# Altium schematic sheet nrf_ha_sensor_USB.SchDoc: PCA70141 MCU
size A4; DocumentNumber: 2; Revision: 0; SheetNumber: 2; SheetTotal: 4; ProjectNumber: <Project number>; DocumentSize: A4; PCBRevision: <PCB designer code>
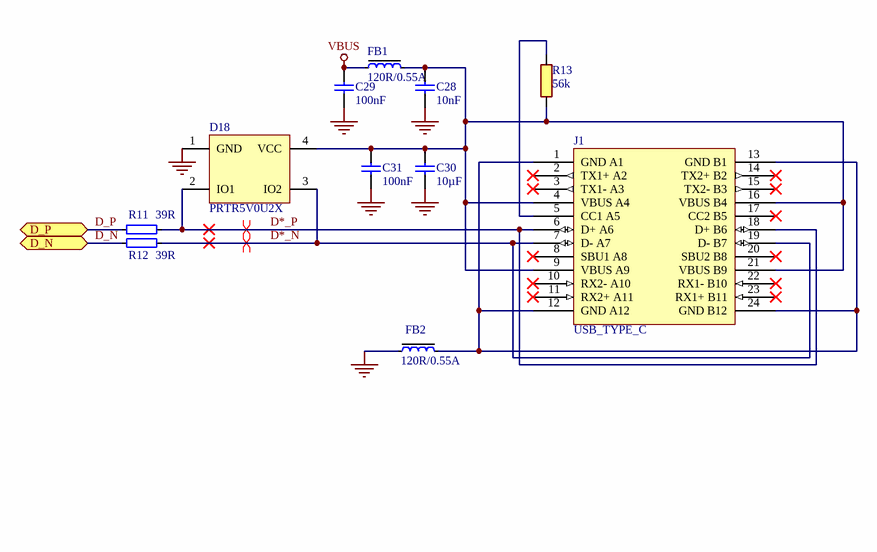
[diagram p0: nrf_ha_sensor_USB.SchDoc]

## Parts
C28  10nF  [CAPC1005X04L]
C29  100nF  [CAPC1005X04L]
C30  10µF  [CAPC1608X06L]
C31  100nF  [CAPC1005X04L]
D18  PRTR5V0U2X  [SOT190P230X110-4L]
FB1  120R/0.55A  [INDC1005X04L]
FB2  120R/0.55A  [INDC1005X04L]
J1  USB_TYPE_C  [USB_TYPE_C_JST]
R11  39R  [RESC1005X04L]
R12  39R  [RESC1005X04L]
R13  56k  [RESC0402(1005)_L]

## Ports
D_N (bidir), D_P (bidir)

## Nets
GND: C28.1 C29.1 C30.1 C31.1 D18.1(GND) FB2.2
VBUS: C29.2 FB1.2
D*_N: D18.3(IO2) J1.7(D-_A7) J1.19(D-_B7) R11.2
D*_P: D18.2(IO1) J1.6(D+_A6) J1.18(D+_B6) R12.2
D_N: R11.1 ; port D_N
D_P: R12.1 ; port D_P
NetC28_2: C28.2 C30.2 C31.2 D18.4(VCC) FB1.1 J1.4(VBUS_A4) J1.9(VBUS_A9) J1.16(VBUS_B4) J1.21(VBUS_B9) R13.1
NetFB2_1: FB2.1 J1.1(GND_A1) J1.12(GND_A12) J1.13(GND_B1) J1.24(GND_B12)
NetJ1_5: J1.5(CC1_A5) R13.2

Not connected (* = marked no-connect by the designer): J1 2(TX1+_A2)* 3(TX1-_A3)* 8(SBU1_A8)* 10(RX2-_A10)* 11(RX2+_A11)* 14(TX2+_B2)* 15(TX2-_B3)* 17(CC2_B5)* 20(SBU2_B8)* 22(RX1-_B10)* 23(RX1+_B11)*

## Layout directives
differential pair: D*_N, D*_P

## Notes on the sheet
- Title
- Size
- Date:
- Project Number
- Sheet         of
- Revision
- File:
- Drawn By:

## Library data of the parts
C28 = C0402-10n: Capacitor, X7R, ±10%; Part number IPS: 00000002386; Note: 16V; Artikkelnr Noca: 20039166; Artikkelnr Simpro: N.A.; Part Number: C0402-10n; Manufacturer: *; Manufacturer Part Number: *; Datasheet: *; LatestRevisionDate: 2009-11-23; Pin Count: 2; Publisher: Nordic Semiconductor; Published: 2009-05-08; Value: 10nF; Supplier: *; Supplier part number: *; 2nd source Supplier: *; 2nd source part number: *; Footprint Doc: 0402
C29 C31 = C0402-100n: Capacitor, X7R, ±10%; Part number IPS: 00000005296; Note: 16V; Artikkelnr Noca: 20039200; Artikkelnr Simpro: N.A.; Part Number: C0402-100n; Manufacturer: *; Manufacturer Part Number: *; Datasheet: *; LatestRevisionDate: 2009-11-23; Pin Count: 2; Publisher: Nordic Semiconductor; Published: 2009-05-08; Value: 100nF; Supplier: *; Supplier part number: *; 2nd source Supplier: *; 2nd source part number: *; Footprint Doc: 0402
C30 = C0603-10µ: Capacitor, X5R, ±20%; Part number IPS: 00000003029; Note: 6.3V; Artikkelnr Noca: 20039234; Artikkelnr Simpro: N.A.; Part Number: C0603-10µ; Manufacturer: *; Manufacturer Part Number: *; Datasheet: *; LatestRevisionDate: 2011-01-17; Pin Count: 2; Publisher: Nordic Semiconductor; Published: 2011-01-17; Value: 10µF; Supplier: *; Supplier part number: *; 2nd source Supplier: *; 2nd source part number: *; Footprint Doc: 0603
D18 = PRTR5V0U2X: Ultra low capacitance double rail-to-rail ESD protection diode; Manufacturer: NXP; 2nd source part number: 152-4157; Artikkelnr Noca: 10069015; Artikkelnr Simpro: N.A.; Part Number: PRTR5V0U2X; Manufacturer Part Number: PRTR5V0U2X; Datasheet: http://www.farnell.com/datasheets/109718.pdf; LatestRevisionDate: 2012-06-11; Publisher: Nordic Semiconductor; Published: 2012-06-11; Value: PRTR5V0U2X; Note: *; Supplier: Digi-Key; Supplier part number: 568-4140-1-ND; 2nd source Supplier: Farnell; Footprint Doc: SOT-143B
FB1 FB2 = FB0402-120R@100M-500mA: Ferrite Bead, 120 Ohm @ 100MHz, 500mA, 250 mOhm Max; Manufacturer: Murata; Manufacturer Part Number: BLM15AG121SN1D; 2nd source part number: 151-5760; Note: Chip EMIFIL Inductor Type Chip Ferrite Bead; Artikkelnr Noca: 33029317; Artikkelnr Simpro: N.A.; Part Number: FB0402-120R@100M-500mA; Datasheet: http://search.murata.co.jp/Ceramy/image/img/PDF/ENG/L0110S0100BLM15A_SN.pdf; Footprint Doc: 0402; LatestRevisionDate: 2014-01-10; Pin Count: 2; Publisher: Nordic Semiconductor; Published: 2011-11-14; Value: 120R/0.55A; Supplier: Digi-Key; Supplier part number: 490-1005-1-ND; 2nd source Supplier: Farnell
J1 = 5676: TH and SMD; id: 5676; pakke_opprettet_av: 1855; leverandor_varenr: 2578451; navn: USB C connector; pris: 20; nokkelord: usb c solder; produsent: JST (JAPAN SOLDERLESS TERMINALS); leverandor: Farnell; komponenttype: 11; pakke_opprettet: 08.02.2020 21:56:58; symbol_opprettet_av: 1855; symbol_opprettet: 08.02.2020 21:55:28
R11 R12 = R0402-39R: Resistor, ±1%, 0.063W; Part number IPS: 00000000821; Note: Chip Res 1%; Artikkelnr Noca: 27049039; Artikkelnr Simpro: N.A.; Value Ohm: 39; Value: 39R; Part Number: R0402-39R; Manufacturer: *; Manufacturer Part Number: *; Datasheet: *; LatestRevisionDate: 2009-11-23; Pin Count: 2; Publisher: Nordic Semiconductor; Published: 2009-05-08; Supplier: Farnell; Supplier part number: 173-8831; 2nd source Supplier: *; 2nd source part number: *; Footprint Doc: 0402
R13 = 5677: 0.1W 1% Thick film resistor; id: 5677; pakke_opprettet_av: 1855; symbol_opprettet_av: 815; pris: 0; pakketype: 0402; komponenttype: 1; pakke_opprettet: 12.05.2019 22:25:28; symbol_opprettet: 08.07.2014 21:16:33; navn: 56k